# Altium schematic sheet MAZ000178 - Diagrama físico.SchDoc: MAZ000178 - Diagrama físico
size A; ApprovedBy: Christian Ledwidth; CheckedBy: Nahuel Martinez; Author: Santiago Marti; CompanyName: Body Health; DrawnBy: Santiago Marti; Revision: A; SheetNumber: 2; SheetTotal: 2
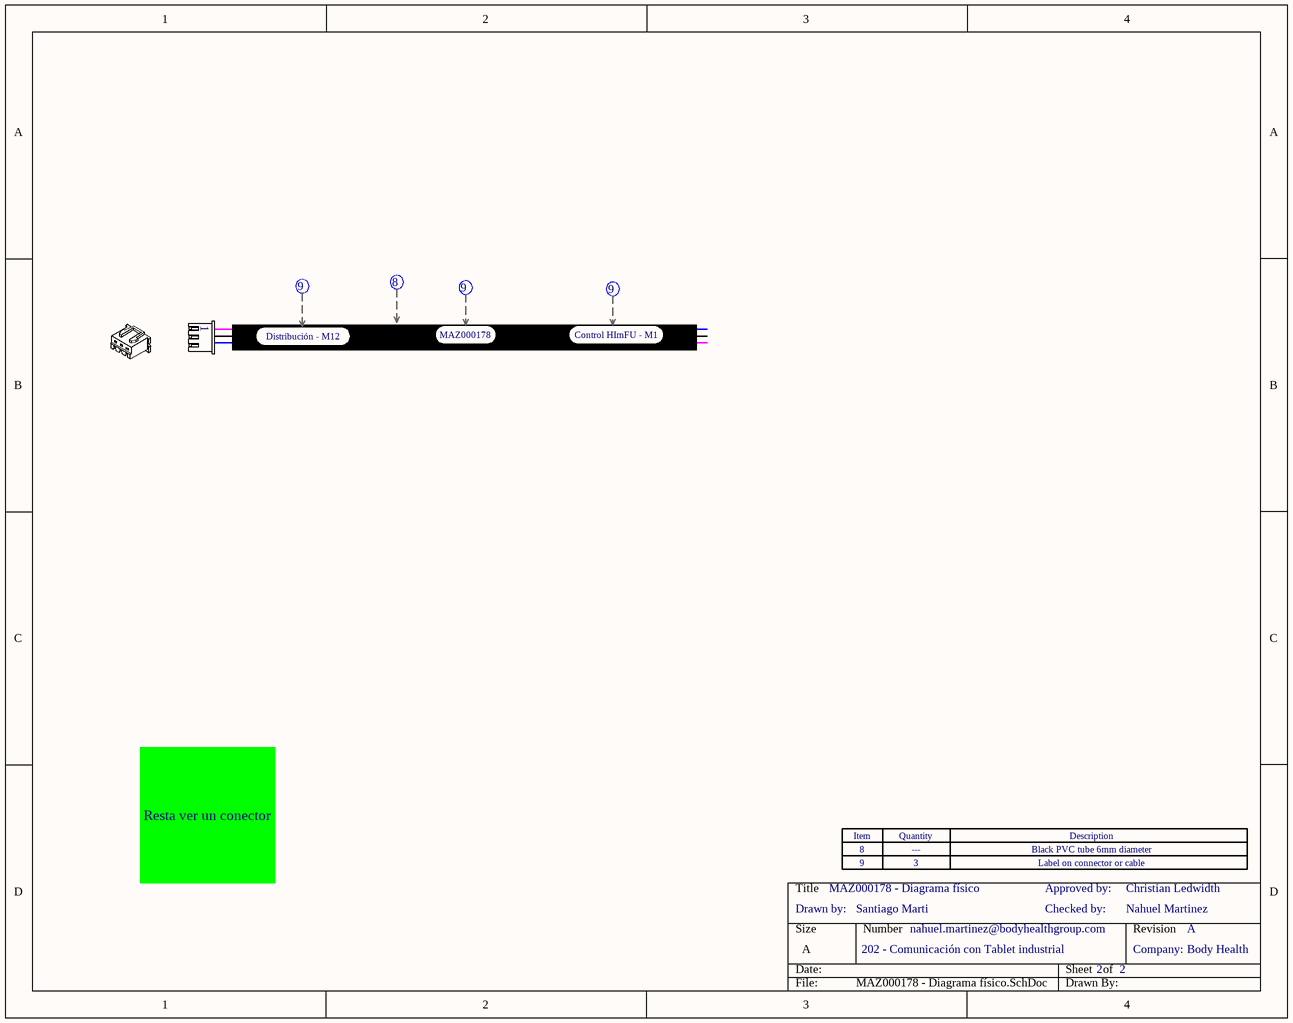
[diagram p0: MAZ000178 - Diagrama físico.SchDoc]

## Parts
(Parts that share a designator on the sheet are numbered #1, #2 ... from top to bottom, then left to right.)
Con?#1  XHP-3  (value not drawn)  (part A of 4)
Con?#2  XHP-3  (value not drawn)  (part B of 4)
Eti1  Etiqueta  (value not drawn)
Eti2  Etiqueta  (value not drawn)
Eti3  Etiqueta  (value not drawn)
Ter1  Termocontraible  (value not drawn)
Zoc1  Zócalo_Header  (value not drawn)
Zoc10  Zócalo_Item  (value not drawn)
Zoc11  Zócalo_Item  (value not drawn)

## Notes on the sheet
- Distribución - M12
- MAZ000178
- (near Eti3) Control HImFU - M1
- Resta ver un conector
- Drawn by:
- 9
- 8
- 3
- ---
- Checked by:
- Approved by:
- Label on connector or cable
- Black PVC tube 6mm diameter
- 202 - Comunicación con Tablet industrial
- nahuel.martinez@bodyhealthgroup.com
- Company:
- (in symbol Zócalo_Header) Item; Quantity; Description

## Library data of the parts
Con?#1 Con?#2 = XHP-3: CONN HOUSING 2.5MM 3POS; Fabricante: JST Sales America Inc.; Cod.DigiKey: 455-2219-ND; Cod.Fabricante: XHP-3; ComponentLink1Description: Manufacturer Link; ComponentLink1URL: http://www.jst-mfg.com/product/pdf/eng/eXH.pdf; DIGIKEYx50: 0.06220; CallOut: *; DIGIKEYx100: NO
Eti1-Eti3 = Etiqueta: CallOut: 9; Texto: *
Ter1 = Termocontraible: CallOut: 8; Largo: *; Diámetro: *
Zoc1 = Zócalo_Header: Header para el zócalo de referencias
Zoc10 Zoc11 = Zócalo_Item: Ítem para el zócalo de referencias; Desginator: *; Quantity: *; ItemDescription: *